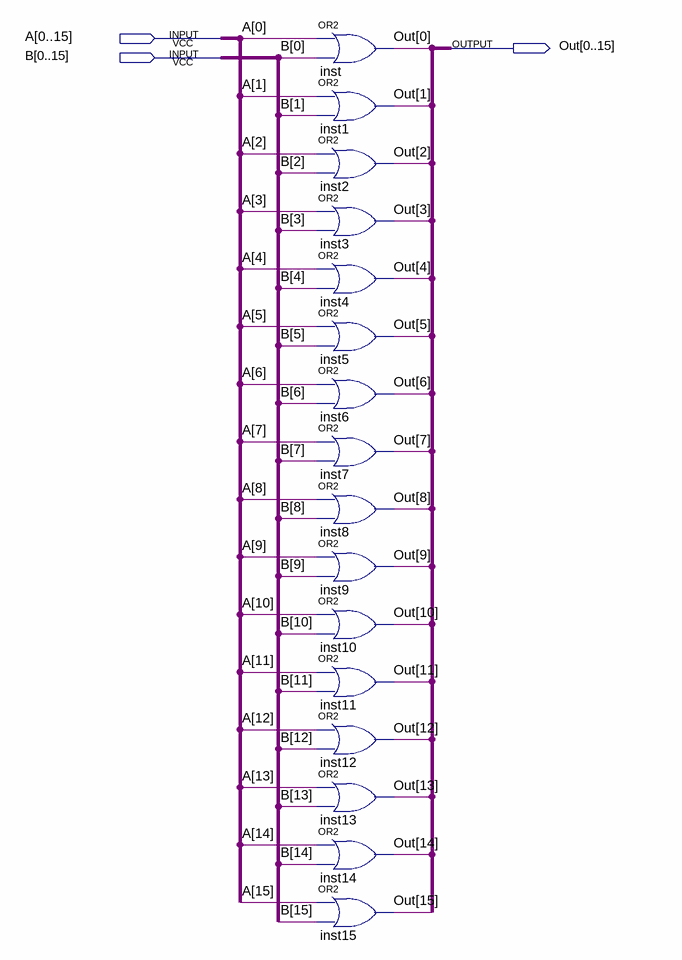
[diagram p0: schematic sheet]
// Quartus schematic or2_bus16.bdf as structural Verilog: 16 symbols, 3 pins
module or2_bus16 (
  input  [0:15] A,
  input  [0:15] B,
  output [0:15] Out
);

  or inst (Out[0], A[0], B[0]);
  or inst1 (Out[1], A[1], B[1]);
  or inst2 (Out[2], A[2], B[2]);
  or inst3 (Out[3], A[3], B[3]);
  or inst4 (Out[4], A[4], B[4]);
  or inst5 (Out[5], A[5], B[5]);
  or inst6 (Out[6], A[6], B[6]);
  or inst7 (Out[7], A[7], B[7]);
  or inst8 (Out[8], A[8], B[8]);
  or inst9 (Out[9], A[9], B[9]);
  or inst10 (Out[10], A[10], B[10]);
  or inst11 (Out[11], A[11], B[11]);
  or inst12 (Out[12], A[12], B[12]);
  or inst13 (Out[13], A[13], B[13]);
  or inst14 (Out[14], A[14], B[14]);
  or inst15 (Out[15], A[15], B[15]);
endmodule
